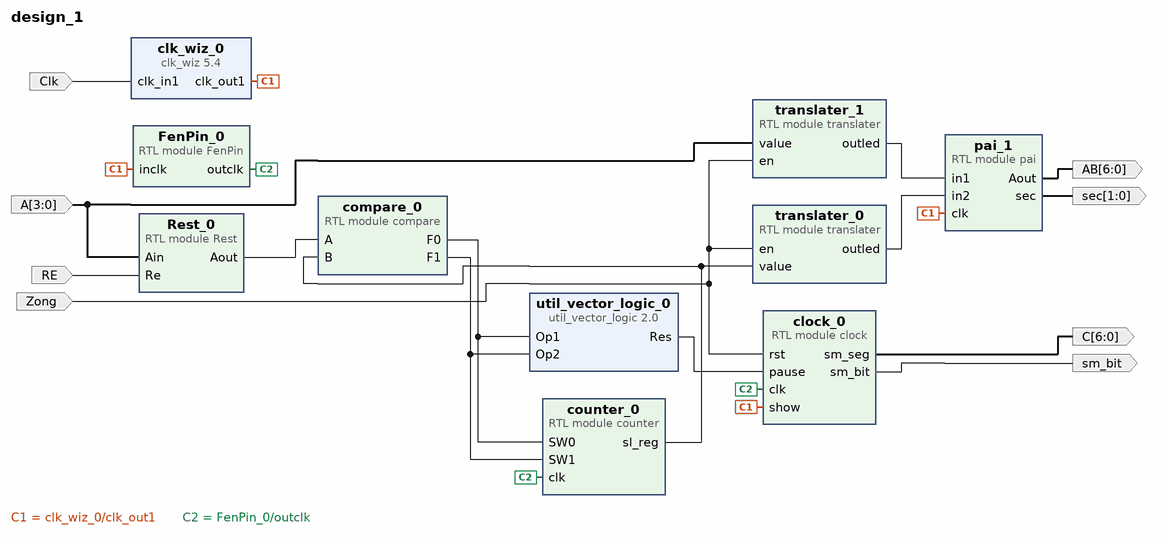
[diagram p0: block diagram of the top level]
# Vivado block design design_1, xc7a35tcsg324-3, Vivado 2017.1
create_bd_design design_1

create_bd_port -dir O -from 6 -to 0 C
create_bd_port -dir I RE
create_bd_port -dir I Zong
create_bd_port -dir I -from 3 -to 0 A
create_bd_port -dir O -from 6 -to 0 AB
create_bd_port -dir O -from 1 -to 0 sec
create_bd_port -dir O sm_bit
create_bd_port -dir I Clk

create_bd_cell -type ip -vlnv xilinx.com:ip:util_vector_logic:2.0 util_vector_logic_0
set_property -dict {CONFIG.C_SIZE 1 CONFIG.C_OPERATION or} [get_bd_cells util_vector_logic_0]
create_bd_cell -type module -reference Rest Rest_0
create_bd_cell -type module -reference translater translater_0
create_bd_cell -type module -reference translater translater_1
create_bd_cell -type ip -vlnv xilinx.com:ip:clk_wiz:5.4 clk_wiz_0
set_property -dict [list \
  CONFIG.PRIMITIVE MMCM \
  CONFIG.CLKOUT1_USED true \
  CONFIG.CLKOUT1_REQUESTED_OUT_FREQ 4.687 \
  CONFIG.CLKOUT1_REQUESTED_PHASE 0.000 \
  CONFIG.CLKOUT1_DRIVES BUFG \
  CONFIG.CLKOUT2_DRIVES BUFG \
  CONFIG.CLKOUT3_DRIVES BUFG \
  CONFIG.CLKOUT4_DRIVES BUFG \
  CONFIG.CLKOUT5_DRIVES BUFG \
  CONFIG.CLKOUT6_DRIVES BUFG \
  CONFIG.CLKOUT7_DRIVES BUFG \
  CONFIG.FEEDBACK_SOURCE FDBK_AUTO \
  CONFIG.USE_LOCKED false \
  CONFIG.USE_RESET false \
  CONFIG.MMCM_DIVCLK_DIVIDE 1 \
  CONFIG.MMCM_CLKFBOUT_MULT_F 6.000 \
  CONFIG.MMCM_CLKIN1_PERIOD 10.0 \
  CONFIG.MMCM_CLKIN2_PERIOD 10.0 \
  CONFIG.MMCM_COMPENSATION ZHOLD \
  CONFIG.MMCM_CLKOUT0_DIVIDE_F 128.000 \
  CONFIG.CLKOUT1_JITTER 278.859 \
  CONFIG.CLKOUT1_PHASE_ERROR 132.063 \
] [get_bd_cells clk_wiz_0]
create_bd_cell -type module -reference pai pai_1
create_bd_cell -type module -reference compare compare_0
create_bd_cell -type module -reference counter counter_0
create_bd_cell -type module -reference FenPin FenPin_0
create_bd_cell -type module -reference clock clock_0

# ---- connections ----

connect_bd_net [get_bd_pins compare_0/F0] [get_bd_pins util_vector_logic_0/Op1] [get_bd_pins counter_0/SW0]
connect_bd_net [get_bd_pins compare_0/F1] [get_bd_pins util_vector_logic_0/Op2] [get_bd_pins counter_0/SW1]
connect_bd_net [get_bd_pins counter_0/sl_reg] [get_bd_pins translater_0/value] [get_bd_pins compare_0/B]
connect_bd_net -net translater_0_led [get_bd_pins translater_0/outled] [get_bd_pins pai_1/in2]
connect_bd_net [get_bd_pins clock_0/sm_seg] [get_bd_ports C]
connect_bd_net [get_bd_ports RE] [get_bd_pins Rest_0/Re]
connect_bd_net [get_bd_pins Rest_0/Aout] [get_bd_pins compare_0/A]
connect_bd_net [get_bd_ports Zong] [get_bd_pins translater_0/en] [get_bd_pins translater_1/en] [get_bd_pins clock_0/rst]
connect_bd_net [get_bd_pins util_vector_logic_0/Res] [get_bd_pins clock_0/pause]
connect_bd_net -net translater_1_led [get_bd_pins translater_1/outled] [get_bd_pins pai_1/in1]
connect_bd_net [get_bd_ports A] [get_bd_pins Rest_0/Ain] [get_bd_pins translater_1/value]
connect_bd_net [get_bd_pins pai_1/Aout] [get_bd_ports AB]
connect_bd_net [get_bd_pins pai_1/sec] [get_bd_ports sec]
connect_bd_net [get_bd_pins clock_0/sm_bit] [get_bd_ports sm_bit]
connect_bd_net [get_bd_ports Clk] [get_bd_pins clk_wiz_0/clk_in1]
connect_bd_net [get_bd_pins clk_wiz_0/clk_out1] [get_bd_pins pai_1/clk] [get_bd_pins FenPin_0/inclk] [get_bd_pins clock_0/show]
connect_bd_net [get_bd_pins FenPin_0/outclk] [get_bd_pins counter_0/clk] [get_bd_pins clock_0/clk]

validate_bd_design
save_bd_design
